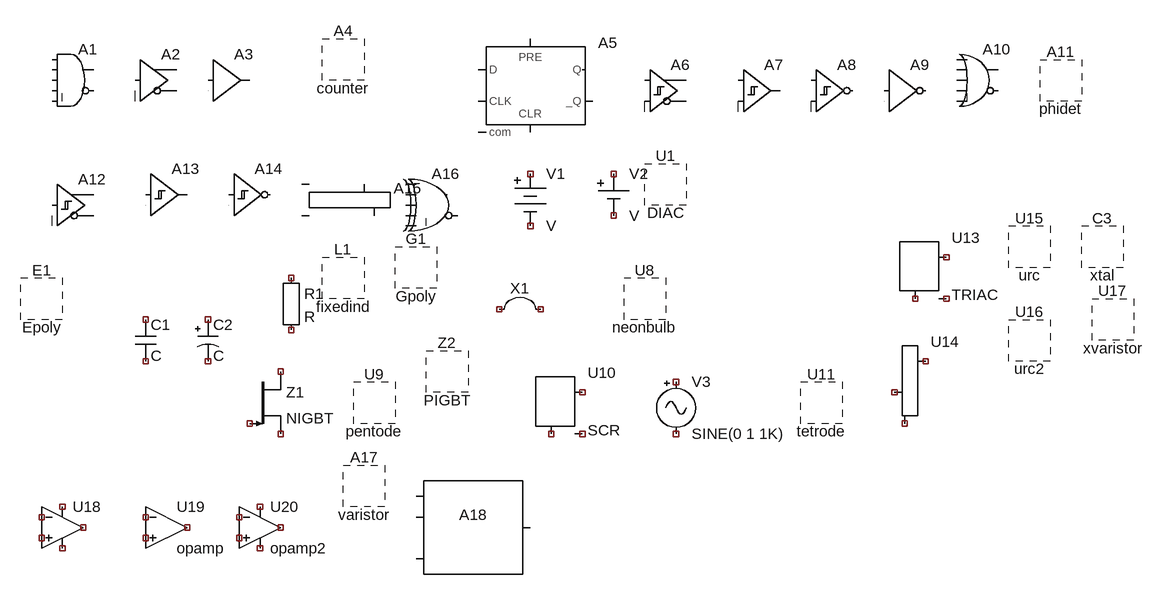
[diagram p0: schematic allLTSpiceLowerDirSymbols.asc]
allLTSpiceLowerDirSymbols.asc, the LTspice schematic file:
Version 4
SHEET 1 1464 760
SYMBOL Digital\\and -560 -464 R0
SYMATTR InstName A1
SYMBOL Digital\\buf -464 -464 R0
SYMATTR InstName A2
SYMBOL Digital\\buf1 -352 -464 R0
SYMATTR InstName A3
SYMBOL Digital\\counter -144 -432 R0
SYMATTR InstName A4
SYMBOL Digital\\dflop 144 -464 R0
SYMATTR InstName A5
SYMBOL Digital\\diffschmitt 320 -448 R0
SYMATTR InstName A6
SYMBOL Digital\\diffschmtbuf 464 -448 R0
SYMATTR InstName A7
SYMBOL Digital\\diffschmtinv 576 -448 R0
SYMATTR InstName A8
SYMBOL Digital\\inv 688 -448 R0
SYMATTR InstName A9
SYMBOL Digital\\or 832 -464 R0
SYMATTR InstName A10
SYMBOL Digital\\phidet 960 -400 R0
SYMATTR InstName A11
SYMBOL Digital\\schmitt -592 -272 R0
SYMATTR InstName A12
SYMBOL Digital\\schmtbuf -448 -288 R0
SYMATTR InstName A13
SYMBOL Digital\\schmtinv -320 -288 R0
SYMATTR InstName A14
SYMBOL Digital\\srflop -160 -288 R0
SYMATTR InstName A15
SYMBOL Digital\\xor 0 -272 R0
SYMATTR InstName A16
SYMBOL Misc\\battery 144 -272 R0
SYMATTR InstName V1
SYMBOL Misc\\cell 272 -256 R0
SYMATTR InstName V2
SYMBOL Misc\\DIAC 352 -240 R0
SYMATTR InstName U1
SYMBOL Misc\\Epoly -608 -64 R0
SYMATTR InstName E1
SYMBOL Misc\\EuropeanCap -464 -32 R0
SYMATTR InstName C1
SYMBOL Misc\\EuropeanPolcap -368 -32 R0
SYMATTR InstName C2
SYMBOL Misc\\EuropeanResistor -240 -112 R0
SYMATTR InstName R1
SYMBOL Misc\\fixedind -144 -96 R0
SYMATTR InstName L1
SYMBOL Misc\\Gpoly -32 -112 R0
SYMATTR InstName G1
SYMBOL Misc\\jumper 128 -112 R0
SYMATTR InstName X1
SYMBOL Misc\\neonbulb 320 -64 R0
SYMATTR InstName U8
SYMBOL Misc\\NIGBT -288 48 R0
SYMATTR InstName Z1
SYMBOL Misc\\pentode -96 96 R0
SYMATTR InstName U9
SYMBOL Misc\\PIGBT 16 48 R0
SYMATTR InstName Z2
SYMBOL Misc\\SCR 208 80 R0
SYMATTR InstName U10
SYMBOL Misc\\signal 368 48 R0
SYMATTR InstName V3
SYMBOL Misc\\tetrode 592 96 R0
SYMATTR InstName U11
SYMBOL Misc\\TRIAC 752 -128 R0
SYMATTR InstName U13
SYMBOL Misc\\triode 752 80 R0
SYMATTR InstName U14
SYMBOL Misc\\urc 912 -144 R0
SYMATTR InstName U15
SYMBOL Misc\\urc2 912 0 R0
SYMATTR InstName U16
SYMBOL Misc\\xtal 1024 -144 R0
SYMATTR InstName C3
SYMBOL Misc\\xvaristor 1040 -32 R0
SYMATTR InstName U17
SYMBOL Opamps\\UniversalOpamp2 -576 288 R0
SYMATTR InstName U18
SYMBOL Opamps\\opamp -416 224 R0
SYMATTR InstName U19
SYMBOL Opamps\\opamp2 -272 224 R0
SYMATTR InstName U20
SYMBOL SpecialFunctions\\varistor -112 224 R0
SYMATTR InstName A17
SYMBOL SpecialFunctions\\sample 48 272 R0
SYMATTR InstName A18

The netlist it stands for:
* allLTSpiceLowerDirSymbols.asc
A1 0 0 0 0 0 0 0 0 AND
A2 0 0 0 0 0 0 0 0 BUF
A3 0 0 0 0 0 0 0 0 BUF
* A4: counter (symbol Digital\counter not available, pin order unknown); nets seen at it: 
A5 0 0 0 0 0 0 0 0 DFLOP
A6 0 0 0 0 0 0 0 0 SCHMITT
A7 0 0 0 0 0 0 0 0 SCHMITT
A8 0 0 0 0 0 0 0 0 SCHMITT
A9 0 0 0 0 0 0 0 0 BUF
A10 0 0 0 0 0 0 0 0 OR
* A11: phidet (symbol Digital\phidet not available, pin order unknown); nets seen at it: 
A12 0 0 0 0 0 0 0 0 SCHMITT
A13 0 0 0 0 0 0 0 0 SCHMITT
A14 0 0 0 0 0 0 0 0 SCHMITT
A15 0 0 0 0 0 0 0 0 SRFLOP
A16 0 0 0 0 0 0 0 0 XOR
V1 NC_01 NC_02 V
V2 NC_03 NC_04 V
* U1: DIAC (symbol Misc\DIAC not available, pin order unknown); nets seen at it: 
* E1: Epoly (symbol Misc\Epoly not available, pin order unknown); nets seen at it: 
C1 NC_05 NC_06 C
C2 NC_07 NC_08 C
R1 NC_09 NC_10 R
* L1: fixedind (symbol Misc\fixedind not available, pin order unknown); nets seen at it: 
* G1: Gpoly (symbol Misc\Gpoly not available, pin order unknown); nets seen at it: 
* U8: neonbulb (symbol Misc\neonbulb not available, pin order unknown); nets seen at it: 
Z1 NC_11 NC_12 NC_13 NIGBT
* U9: pentode (symbol Misc\pentode not available, pin order unknown); nets seen at it: 
* Z2: PIGBT (symbol Misc\PIGBT not available, pin order unknown); nets seen at it: 
* U10: SCR (symbol Misc\SCR not certain, pin order unknown); nets seen at it: 
V3 NC_17 NC_18 SINE(0 1 1K)
* U11: tetrode (symbol Misc\tetrode not available, pin order unknown); nets seen at it: 
XU13 NC_19 NC_20 NC_21 TRIAC  ; pins MT2 G MT1
XU14 NC_22 NC_23 NC_24 triode
* U15: urc (symbol Misc\urc not available, pin order unknown); nets seen at it: 
* U16: urc2 (symbol Misc\urc2 not available, pin order unknown); nets seen at it: 
* C3: xtal (symbol Misc\xtal not available, pin order unknown); nets seen at it: 
* U17: xvaristor (symbol Misc\xvaristor not available, pin order unknown); nets seen at it: 
XU18 NC_25 NC_26 NC_27 NC_28 NC_29 level.2 Avol=1Meg GBW=10Meg Slew=10Meg ilimit=25m rail=0 Vos=0 phimargin=45 en=0 enk=0 in=0 ink=0 Rin=500Meg  ; pins IN+ IN- V+ V- OUT
XU19 NC_30 NC_31 NC_32 opamp Aol=100K GBW=10Meg  ; pins invin noninvin out
XU20 NC_33 NC_34 NC_35 NC_36 NC_37 opamp2  ; pins In+ In- V+ V- OUT
* A17: varistor (symbol SpecialFunctions\varistor not available, pin order unknown); nets seen at it: 
A18 0 0 0 0 0 0 0 0 SAMPLEHOLD
.lib UniversalOpamps2.sub
.backanno
.end